# Altium schematic sheet ESP32.SchDoc
size 420 x 297 mm; SheetNumber: 2; SheetTotal: 4
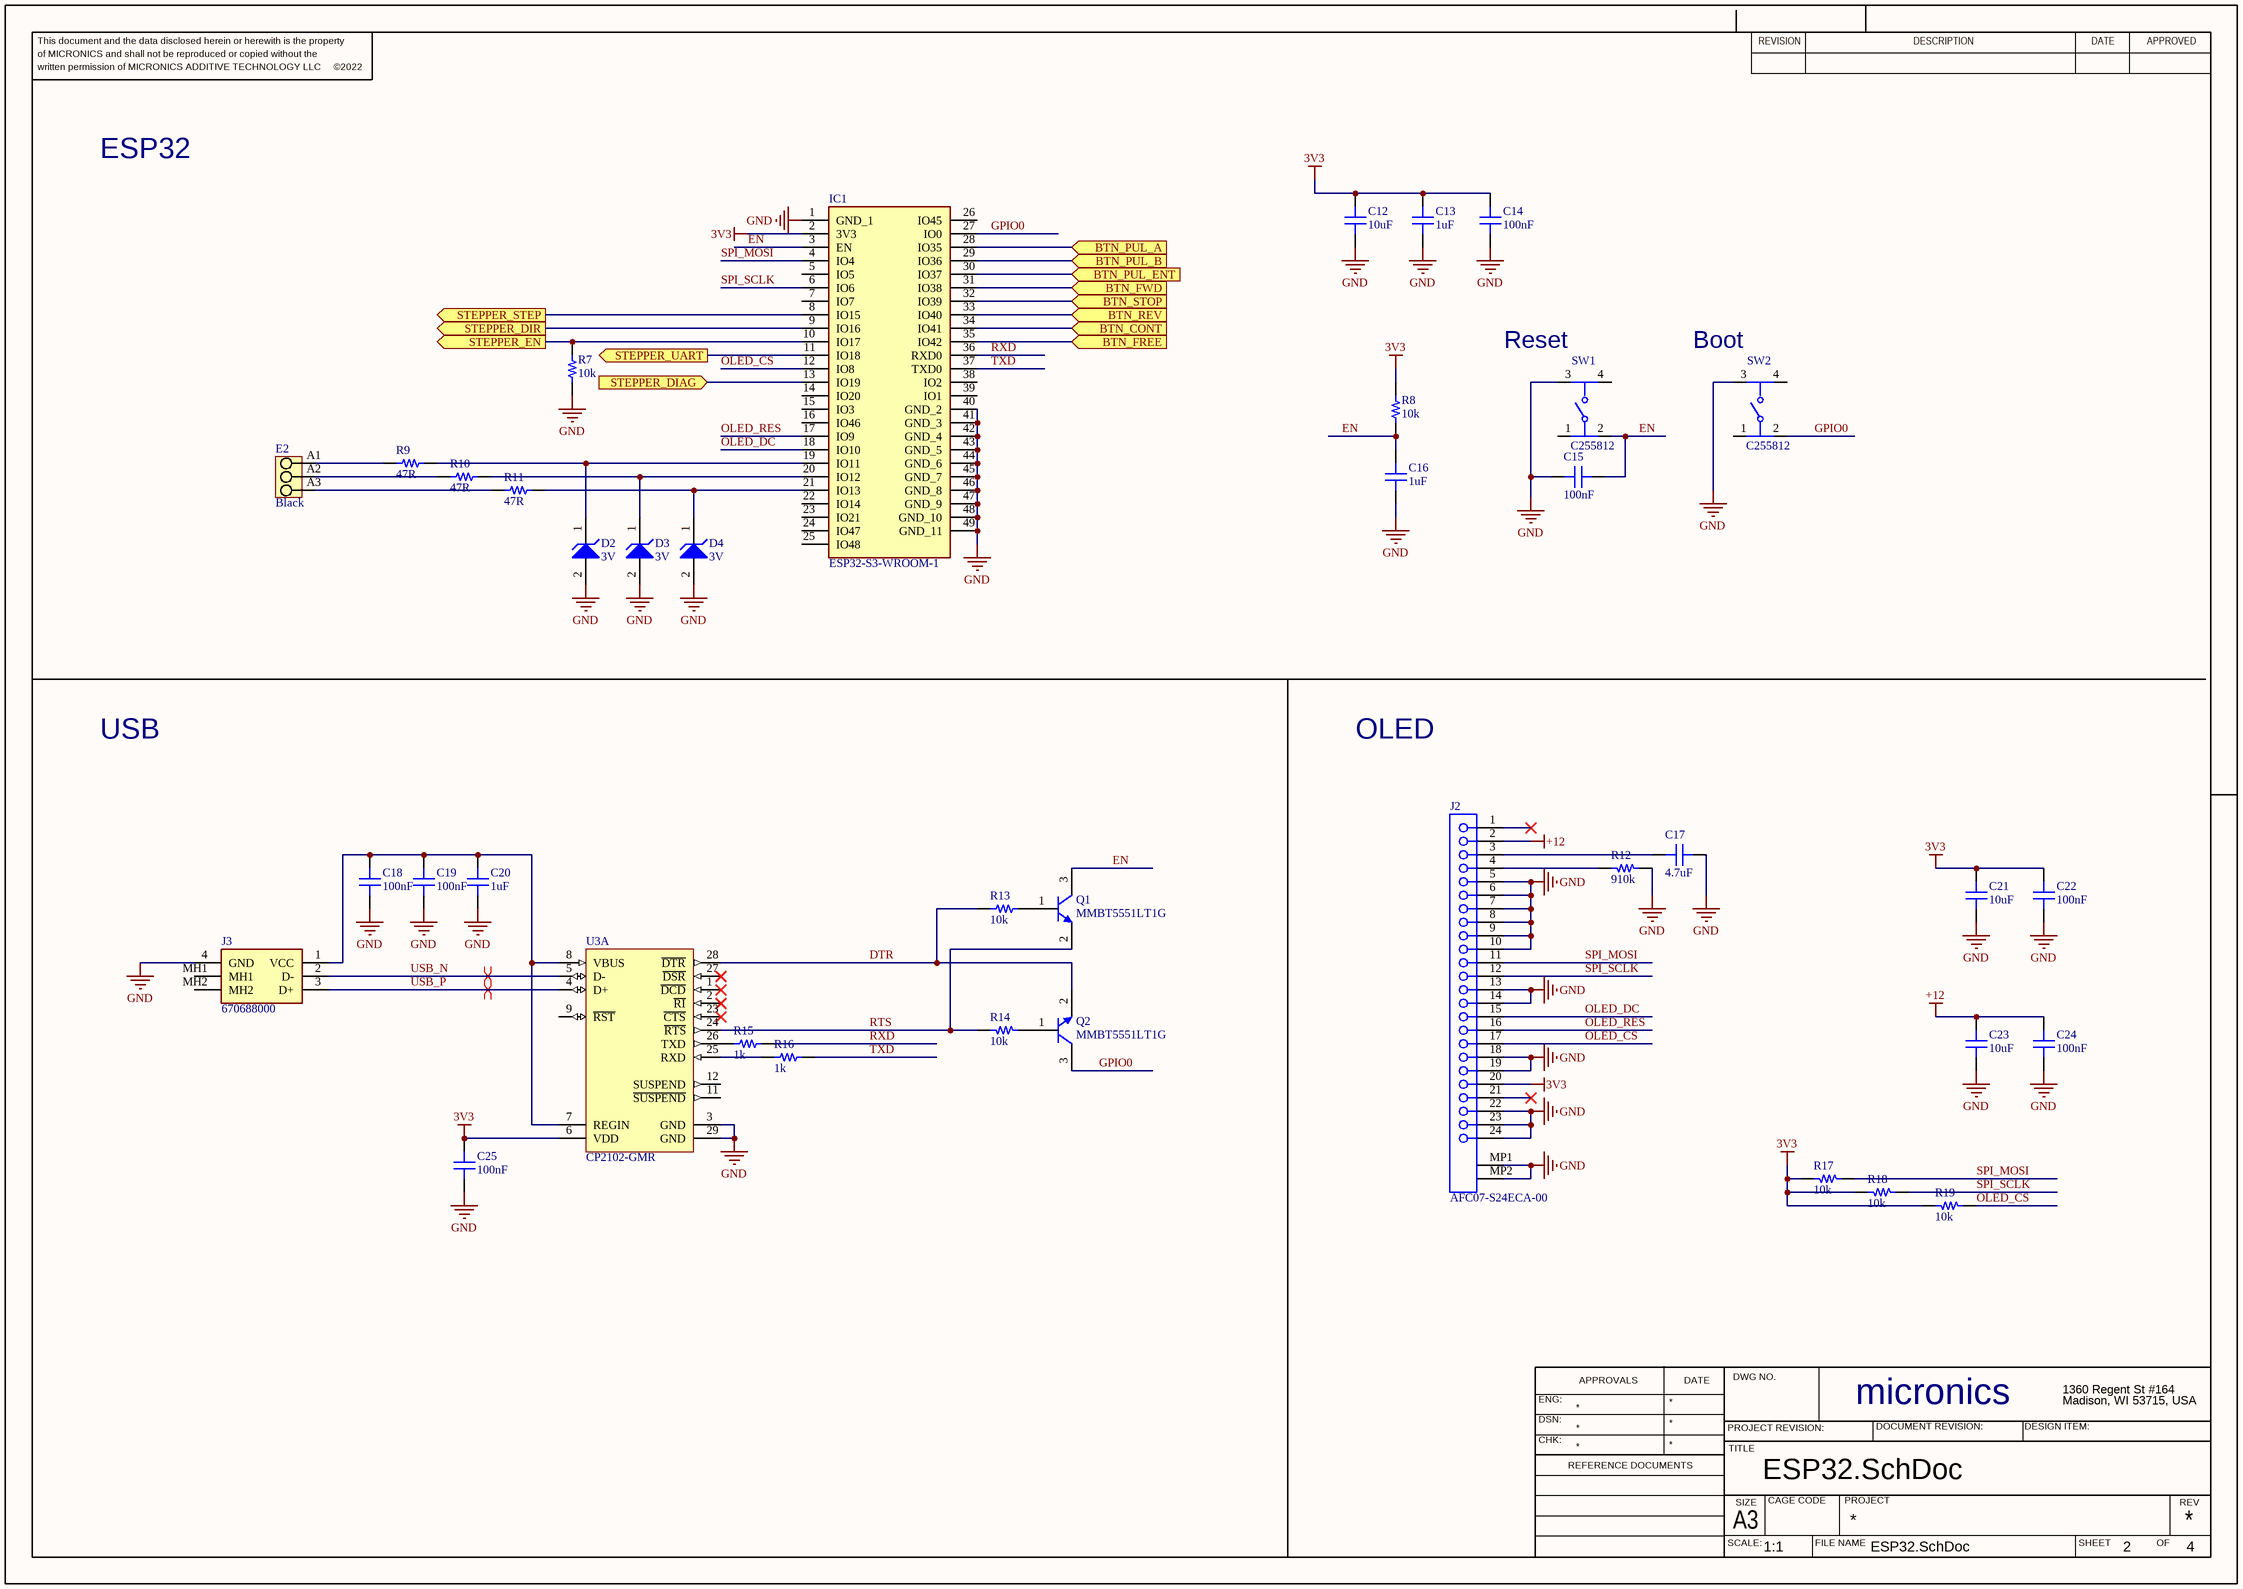
[diagram p0: ESP32.SchDoc]

## Parts
C12  10uF  [CAP 1206_3216 - 0.8MM]
C13  1uF  [CAP 0603_1608]
C14  100nF  [CAP 0603_1608]
C15  100nF  [CAP 0603_1608]
C16  1uF  [CAP 0603_1608]
C17  4.7uF  [CAP 1206_3216 - 0.8MM]
C18  100nF  [CAP 0603_1608]
C19  100nF  [CAP 0603_1608]
C20  1uF  [CAP 0603_1608]
C21  10uF  [CAP 1206_3216 - 0.8MM]
C22  100nF  [CAP 0603_1608]
C23  10uF  [CAP 1206_3216 - 0.8MM]
C24  100nF  [CAP 0603_1608]
C25  100nF  [CAP 0603_1608]
D2  3V  [ONSC-SOD-123-2-425-04_V]
D3  3V  [ONSC-SOD-123-2-425-04_V]
D4  3V  [ONSC-SOD-123-2-425-04_V]
E2  Black  [PM_5_08_90_03]
IC1  ESP32-S3-WROOM-1  [ESP32S3WROOM1]
J2  AFC07-S24ECA-00  [MOLX-52437-2471]
J3  670688000  [670688000]
Q1  MMBT5551LT1G  [ONSC-SOT-23-3-318-08_V]
Q2  MMBT5551LT1G  [ONSC-SOT-23-3-318-08_V]
R7  10k  [RES 0603_1608]
R8  10k  [RES 0603_1608]
R9  47R  [RES 0603_1608]
R10  47R  [RES 0603_1608]
R11  47R  [RES 0603_1608]
R12  910k  [RES 0603_1608]
R13  10k  [RES 0603_1608]
R14  10k  [RES 0603_1608]
R15  1k  [RES 0603_1608]
R16  1k  [RES 0603_1608]
R17  10k  [RES 0603_1608]
R18  10k  [RES 0603_1608]
R19  10k  [RES 0603_1608]
SW1  C255812  [FP-FSM2JSMAA-MFG]
SW2  C255812  [FP-FSM2JSMAA-MFG]
U3  CP2102-GMR  [SLAB-QFN-28-3125x3125TP_M]  (part A of 2)

## Ports
BTN_CONT (in, see Buttons[2C]), BTN_FREE (in, see Buttons[3C]), BTN_FWD (in, see Buttons[5A]), BTN_PUL_A (in, see Buttons[3A]), BTN_PUL_B (in, see Buttons[3B]), BTN_PUL_ENT (in, see Buttons[3B]), BTN_REV (in, see Buttons[5C]), BTN_STOP (in, see Buttons[5B]), STEPPER_DIAG (in), STEPPER_DIR (out, see Stepper[2B]), STEPPER_EN (out, see Stepper[2C]), STEPPER_STEP (out, see Stepper[2B]), STEPPER_UART (out)

## Nets
3V3: C12.2 C13.2 C14.1 C21.2 C22.1 C25.1 IC1.2(3V3) J2.20 R8.1 R17.2 R18.2 R19.2 U3.6(VDD)
+12: C23.2 C24.1 J2.2
GND: C12.1 C13.1 C14.2 C15.2 C16.1 C17.1 C18.2 C19.2 C20.1 C21.1 C22.2 C23.1 C24.2 C25.2 D2.2(A) D3.2(A) D4.2(A) IC1.1(GND_1) IC1.40(GND_2) IC1.41(GND_3) IC1.42(GND_4) IC1.43(GND_5) IC1.44(GND_6) IC1.45(GND_7) IC1.46(GND_8) IC1.47(GND_9) IC1.48(GND_10) IC1.49(GND_11) J2.5 J2.6 J2.7 J2.8 J2.9 J2.10 J2.13 J2.14 J2.18 J2.19 J2.22 J2.23 J2.24 J2.MP1 J2.MP2 J3.4(GND) R7.2 R12.2 SW1.3 SW2.3 U3.3(GND) U3.29(GND)
BTN_CONT: IC1.34(IO41) ; port BTN_CONT
BTN_FREE: IC1.35(IO42) ; port BTN_FREE
BTN_FWD: IC1.31(IO38) ; port BTN_FWD
BTN_PUL_A: IC1.28(IO35) ; port BTN_PUL_A
BTN_PUL_B: IC1.29(IO36) ; port BTN_PUL_B
BTN_PUL_ENT: IC1.30(IO37) ; port BTN_PUL_ENT
BTN_REV: IC1.33(IO40) ; port BTN_REV
BTN_STOP: IC1.32(IO39) ; port BTN_STOP
DTR: Q2.2(E) R13.1 U3.28(~{DTR})
EN: C15.1 C16.2 IC1.3(EN) Q1.3(C) R8.2 SW1.2
GPIO0: IC1.27(IO0) Q2.3(C) SW2.2
OLED_CS: IC1.12(IO8) J2.17 R19.1
OLED_DC: IC1.18(IO10) J2.15
OLED_RES: IC1.17(IO9) J2.16
RTS: Q1.2(E) R14.1 U3.24(~{RTS})
RXD: IC1.36(RXD0) R15.2
SPI_MOSI: IC1.4(IO4) J2.11 R17.1
SPI_SCLK: IC1.6(IO6) J2.12 R18.1
STEPPER_DIAG: IC1.13(IO19) ; port STEPPER_DIAG
STEPPER_DIR: IC1.9(IO16) ; port STEPPER_DIR
STEPPER_EN: IC1.10(IO17) R7.1 ; port STEPPER_EN
STEPPER_STEP: IC1.8(IO15) ; port STEPPER_STEP
STEPPER_UART: IC1.11(IO18) ; port STEPPER_UART
TXD: IC1.37(TXD0) R16.2
USB_N: J3.2(D-) U3.5(D-)
USB_P: J3.3(D+) U3.4(D+)
NetC17_2: C17.2 J2.3
NetC18_1: C18.1 C19.1 C20.2 J3.1(VCC) U3.7(REGIN) U3.8(VBUS)
NetD2_1: D2.1(K) IC1.19(IO11) R9.2
NetD3_1: D3.1(K) IC1.20(IO12) R10.2
NetD4_1: D4.1(K) IC1.21(IO13) R11.2
NetE2_A1: E2.A1 R9.1
NetE2_A2: E2.A2 R10.1
NetE2_A3: E2.A3 R11.1
NetJ2_4: J2.4 R12.1
NetQ1_1: Q1.1(B) R13.2
NetQ2_1: Q2.1(B) R14.2
NetR15_1: R15.1 U3.26(TXD)
NetR16_1: R16.1 U3.25(RXD)

Not connected (* = marked no-connect by the designer): IC1 5(IO5) 7(IO7) 14(IO20) 15(IO3) 16(IO46) 22(IO14) 23(IO21) 24(IO47) 25(IO48) 26(IO45) 38(IO2) 39(IO1); J2 1* 21*; J3 MH1 MH2; SW1 1 4; SW2 1 4; U3 1(~{DCD})* 2(~{RI})* 9(~{RST}) 11(~{SUSPEND}) 12(SUSPEND) 23(~{CTS})* 27(~{DSR})*

## Layout directives
differential pair; differential pair class USB: USB_N, USB_P

## Notes on the sheet
- ESP32
- (near SW1) Reset
- (near SW2) Boot
- USB
- OLED
- This document and the data disclosed herein or herewith is the property
- of MICRONICS and shall not be reproduced or copied without the
- REVISION
- DESCRIPTION
- DATE
- APPROVED
- written permission of MICRONICS ADDITIVE TECHNOLOGY LLC     ©2022
- ENG:
- APPROVALS
- DWG NO.
- micronics
- 1360 Regent St #164
- Madison, WI 53715, USA
- DSN:
- CHK:
- REFERENCE DOCUMENTS
- PROJECT REVISION:
- TITLE
- DOCUMENT REVISION:
- DESIGN ITEM:
- SCALE:
- A3
- SIZE
- CAGE CODE
- FILE NAME
- PROJECT
- SHEET
- OF
- REV
- 1:1

## Library data of the parts
C12 C21 C23 = MM061A101JCT2A: C89632; manufacturer: AVX Corporation; Temperature Coefficient: C0G, NP0; Tolerance: ±5%; Voltage - Rated: 100V; Part Number: MM061A101JCT2A; Value: 10uF; Applications: Medical, Non-Critical; Capacitance: 10uF; componentlink1description: Datasheet; componentlink1url: http://datasheets.avx.com/AVX-MM.pdf; componentlink2description: DigiKey Link; componentlink2url: http://digikey.com/product-detail/en/avx-corporation/MM061A101JCT2A/478-10622-1-ND/7344883; Device Package: 1206 (3216 Metric); lastupdated: 2020-09-02 1:04:46 AM; Lifecycle Status: Active; Minimum Order: 1; Mounting Type: Surface Mount, MLCC; Operating Temperature: -55°C ~ 125°C; Package / Case: 1206 (3216 Metric); packaging: TapeAndReel; partid: 18685; Part Status: Active; price: 0.52; series: MM; Size / Dimension: 0.126" L x 0.063" W (3.20mm x 1.60mm); Supplier 1: DigiKey; Supplier Part Number 1: 478-10622-1-ND; Thickness (Max): 0.029" (0.74mm)
C13 C16 C20 = 250X14W223MV4T: C15849; manufacturer: Johanson Dielectrics Inc.; Temperature Coefficient: X7R; Tolerance: ±20%; Voltage - Rated: 25V; Part Number: 250X14W223MV4T; Value: 1uF; Applications: Bypass, Decoupling; Capacitance: 1uF; componentlink1description: Datasheet; componentlink1url: https://www.johansondielectrics.com/downloads/x2y-filter-and-decoupling-capacitors.pdf; componentlink2description: DigiKey Link; componentlink2url: https://www.digikey.com/en/products/detail/johanson-dielectrics-inc/250X14W223MV4T/1628740; Device Package: 0603 (1608 Metric); Features: Low ESL (X2Y); lastupdated: 2022-05-16 11:25:57 AM; Lifecycle Status: Active; Minimum Order: 1; Mounting Type: Surface Mount, MLCC; Operating Temperature: -55°C ~ 125°C; Package / Case: 0603 (1608 Metric); packaging: TapeAndReel; partid: 14325; Part Status: Active; price: 0.07; series: X2Y®; Size / Dimension: 0.064" L x 0.035" W (1.63mm x 0.89mm); Supplier 1: DigiKey; Supplier Part Number 1: 709-1087-1-ND; Thickness (Max): 0.026" (0.66mm)
C14 C15 C18 C19 C22 C24 C25 = 250X14W223MV4T: C14663; manufacturer: Johanson Dielectrics Inc.; Temperature Coefficient: X7R; Tolerance: ±20%; Voltage - Rated: 25V; Part Number: 250X14W223MV4T; Value: 100nF; Applications: Bypass, Decoupling; Capacitance: 100nF; componentlink1description: Datasheet; componentlink1url: https://www.johansondielectrics.com/downloads/x2y-filter-and-decoupling-capacitors.pdf; componentlink2description: DigiKey Link; componentlink2url: https://www.digikey.com/en/products/detail/johanson-dielectrics-inc/250X14W223MV4T/1628740; Device Package: 0603 (1608 Metric); Features: Low ESL (X2Y); lastupdated: 2022-05-16 11:25:57 AM; Lifecycle Status: Active; Minimum Order: 1; Mounting Type: Surface Mount, MLCC; Operating Temperature: -55°C ~ 125°C; Package / Case: 0603 (1608 Metric); packaging: TapeAndReel; partid: 14325; Part Status: Active; price: 0.07; series: X2Y®; Size / Dimension: 0.064" L x 0.035" W (1.63mm x 0.89mm); Supplier 1: DigiKey; Supplier Part Number 1: 709-1087-1-ND; Thickness (Max): 0.026" (0.66mm)
C17 = MM061A101JCT2A: C29823; manufacturer: AVX Corporation; Temperature Coefficient: C0G, NP0; Tolerance: ±5%; Voltage - Rated: 100V; Part Number: MM061A101JCT2A; Value: 4.7uF; Applications: Medical, Non-Critical; Capacitance: 4.7uF; componentlink1description: Datasheet; componentlink1url: http://datasheets.avx.com/AVX-MM.pdf; componentlink2description: DigiKey Link; componentlink2url: http://digikey.com/product-detail/en/avx-corporation/MM061A101JCT2A/478-10622-1-ND/7344883; Device Package: 1206 (3216 Metric); lastupdated: 2020-09-02 1:04:46 AM; Lifecycle Status: Active; Minimum Order: 1; Mounting Type: Surface Mount, MLCC; Operating Temperature: -55°C ~ 125°C; Package / Case: 1206 (3216 Metric); packaging: TapeAndReel; partid: 18685; Part Status: Active; price: 0.52; series: MM; Size / Dimension: 0.126" L x 0.063" W (3.20mm x 1.60mm); Supplier 1: DigiKey; Supplier Part Number 1: 478-10622-1-ND; Thickness (Max): 0.029" (0.74mm)
D2-D4 = CMP-1060-00257-1: C12756; PartNumber: SZMMSZ12T3G; Manufacturer: On Semiconductor; P Max (W): 0.5; Packing: Tape and Reel; PackageDescription: 2-Pin SOD, Body 1.6 x 2.69 mm; RoHS: Pb-Free; PackageReference: SOD-123-2-425-04; ComponentLink1Description: Manufacturer URL; ComponentLink3URL: http://www.onsemi.com/pub_link/Collateral/425-04.PDF; Mounting Technology: Surface Mount; ComponentLink2URL: http://www.onsemi.com/pub_link/Collateral/MMSZ2V4T1-D.PDF; ComponentLink1URL: http://www.onsemi.com/; ComponentLink3Description: Package Specification; ComponentLink2Description: Datasheet; DatasheetVersion: Rev. 11; PackageVersion: Rev. G, 10/2009
E2 = CMP-1559-01629-1: C430602; PartNumber: 1760500000; Manufacturer: Weidmueller; Pitch_mm: 5,08 mm; Pitch_inch: 0,2 inch; Wire_cross_section_AWG_min_UL_1059: AWG 26; Contact_surface: tinned; Contact_material: Cu-Leg; Short_text_for_material: PM 5.08/03/90 3.5SN OR BX; Rated_voltage_use_group_B_UL_1059: 300 V; Solid_min_H05_07_V_U: 0,13 mm²; Solder_pin_length_mm: 3,5 mm; Rated_voltage_for_surge_voltage_class_pollution_degree_II_2: 600 V; Mounting_onto_the_PCB: Solder connection; Solid_max_H05_07_V_U: 2,5 mm²; Side_termination_characteristic: closed side; Rated_current_use_group_B_UL_1059: 15 A; Wire_cross_section_AWG_max_UL_1059: AWG 14; Insulating_material: Wemid (PA); UL_94_flammability_rating: V-0; No_of_poles: 3; ComponentLink2Description: URL Link1; ComponentLink1Description: Manufacturer URL; ComponentLink2URL: http://catalog.weidmueller.com/catalog/Start.do?localeId=en&ObjectID=1760500000; ComponentLink1URL: http://www.weidmueller.com/; Qty: 500 PCS; Colour: Orange; Packaging: Box; Revision: V1; PackageReference: PM_5_08_90_03
IC1 = ESP32-S3-WROOM-1: Integrated Circuit; Manufacturer_Name: Espressif Systems; Datasheet Link: https://www.mouser.com/catalog/specsheets/Espressif_ESP32_S3_WROOM_1_1U_Preliminary.pdf; Height: 3.25mm; Manufacturer_Part_Number: ESP32-S3-WROOM-1
J2 = CMP-1241-00285-1: C262643; PartNumber: 52437-2471; Manufacturer: Molex; Material - Metal: Phosphor Bronze; Material - Plating Mating: Gold; Durability (mating cycles max): 20; Stackable: No; Contact Position: Bottom; Entry Angle: 90degrees Angle; Circuits (Loaded): 24; Current (Max per Contact): 0.5A; PCB Retention: None; Packing: Tape and Reel; Pitch - Mating Interface: 0.50mm; Polarized to PCB: Yes; Voltage (Max): 50V; ComponentLink2URL: http://www.molex.com/webdocs/datasheets/pdf/en-us/0524372471_FFC_FPC_CONNECTORS.pdf; ComponentLink1URL: http://www.molex.com/molex/index.jsp; Mounting Technology: Surface Mount; RoHS: TRUE; ComponentLink3Description: Package Specification; ComponentLink2Description: Datasheet; PackageReference: 52437-2471; ComponentLink3URL: http://www.molex.com/pdm_docs/sd/524372471_sd.pdf; ComponentLink1Description: Manufacturer URL; PackageVersion: Rev. E, 07/2013; Number of Rows: 1; PCB Locator: No; PackageDescription: 24-Lead FPC Connector, Pitch 0.5 mm; Material - Plating Termination: Gold; Orientation: Right Angle
J3 = 67068-8000: Connector; Manufacturer_Name: Molex; Datasheet Link: https://www.molex.com/pdm_docs/sd/670688000_sd.pdf; Height: 11mm; Manufacturer_Part_Number: 67068-8000; Mouser Part Number: 538-67068-8000; Mouser Price/Stock: https://www.mouser.co.uk/ProductDetail/Molex/67068-8000?qs=N76qWb2E9MLsLGBiHvIzzg%3D%3D
Q1 Q2 = CMP-1048-00669-1: C41095; Manufacturer: On Semiconductor; IC Continuous (A): 0.6; Packing: Tape and Reel; Polarity: NPN; ComponentLink2URL: http://www.onsemi.cn/pub_link/Collateral/MMBT5550LT1-D.PDF; ComponentLink3Description: Package Specification; DatasheetVersion: Rev. 10; ComponentLink1URL: http://www.onsemi.com/; ComponentLink2Description: Datasheet; ComponentLink1Description: Manufacturer URL; PartNumber: MMBT5551LT1G; RoHS: TRUE; PackageReference: SOT-23-3-318-08; Mounting Technology: Surface Mount; PackageVersion: Rev. AP, 11/2009; ComponentLink3URL: http://www.onsemi.cn/pub_link/Collateral/318-08.PDF; PackageDescription: 3-Pin Small Outline Transistor, Body 2.92 x 1.3 mm, Pitch 0.95 mm
R7-R11 R13-R19 = RNCF0603DTE23K2: RES 1% 0603; Manufacturer: Stackpole Electronics Inc; Power (Watts): 0.1W, 1/10W; Temperature Coefficient: ±25ppm/°C; Tolerance: ±0.5%; Part Number: RNCF0603DTE23K2; ComponentLink1Description: Datasheet; ComponentLink1URL: https://www.seielect.com/catalog/sei-rncf.pdf; ComponentLink2Description: DigiKey Link; ComponentLink2URL: https://www.digikey.com/en/products/detail/stackpole-electronics-inc/RNCF0603DTE23K2/6264115; Composition: Thin Film; Device Package: 0603 (1608 Metric); Features: Automotive AEC-Q200; Height - Seated (Max): 0.022" (0.55mm); LastUpdated: 2022-05-20 3:01:33 PM; Lifecycle Status: Active; Minimum Order: 1; Number of Terminations: 2; Operating Temperature: -55°C ~ 155°C; Package / Case: 0603 (1608 Metric); Packaging: TapeAndReel; PartId: 5426; Part Status: Active; Price: 0.01; Ratings: AEC-Q200; Series: RNCF; Size / Dimension: 0.061" L x 0.031" W (1.55mm x 0.80mm); Supplier 1: DigiKey; Supplier Part Number 1: RNCF0603DTE23K2CT-ND; Supplier Device Package: 0603
  R7 R8 R13 R14 R17-R19: Value: 10k; Resistance: 10k
  R9-R11: Value: 47R; Resistance: 47R
  R15 R16: Value: 1k; Resistance: 1k
R12 = RNCS0603BKE10K0: RES 1% 0603; Manufacturer: Stackpole Electronics Inc; Power (Watts): 0.063W, 1/16W; Temperature Coefficient: ±25ppm/°C; Tolerance: ±0.1%; Part Number: RNCS0603BKE10K0; Value: 910k; ComponentLink1Description: Datasheet; ComponentLink1URL: https://www.seielect.com/catalog/sei-rncs_rnch.pdf; ComponentLink2Description: DigiKey Link; ComponentLink2URL: https://www.digikey.com/en/products/detail/stackpole-electronics-inc/RNCS0603BKE10K0/1708836; Composition: Thin Film; Device Package: 0603 (1608 Metric); Features: Anti-Corrosive, Automotive AEC-Q200, Moisture Resistant; Height - Seated (Max): 0.022" (0.55mm); LastUpdated: 2022-05-20 3:01:34 PM; Lifecycle Status: Active; Minimum Order: 1; Number of Terminations: 2; Operating Temperature: -55°C ~ 155°C; Package / Case: 0603 (1608 Metric); Packaging: TapeAndReel; PartId: 4838; Part Status: Active; Price: 0.08; Ratings: AEC-Q200; Resistance: 910k; Series: RNCS; Size / Dimension: 0.061" L x 0.031" W (1.55mm x 0.80mm); Supplier 1: DigiKey; Supplier Part Number 1: RNCS0603BKE10K0CT-ND; Supplier Device Package: 0603
SW1 SW2 = CMP-03402-000003-1: SWITCH TACTILE SPST-NO 0.05A 24V; Manufacturer Part Number: FSM2JSMAA; Manufacturer: TE Connectivity; Standoff Height: 0.05mm; Contact Current Rating: 50mA; Electromechanical Life: 100000Cycles; Operating Force: 260gf; Contact Resistance: 100mΩ; Package: 0; Temperature Range High: +85°C; Temperature: -35°C to +85°C; Category: Switch; RoHS: TRUE; Mouser Description: Tactile Switches TACTILE 260G FORCE S; Device Class L1: Electromechanical; Mount: Surface Mount; Height: 4.59mm; ComponentLink2URL: https://www.te.com/commerce/DocumentDelivery/DDEController?Action=showdoc&DocId=Customer+Drawing%7F2-1437565-7%7FV%7Fpdf%7FEnglish%7FENG_CD_2-1437565-7_V.pdf%7F2-1437565-8; Temperature Range Low: -35°C; Voltage Rating Dc: 24V; Lead Free: Yes; Automotive: No; Throw Configuration: SPST-NO; Octopart: https://octopart.com/fsm2jsmaa-te+connectivity-41720620; Device Class L2: Switches; Device Class L3: Pushbutton Switches; ComponentLink2Description: Datasheet; Digikey Description: SWITCH TACTILE SPST-NO 0.05A 24V
U3 = CMP-2000-04924-1: Single-Chip USB to URAT Bridge, 3.3 V, -40 to 85 degC, 28-Pin QFN, RoHS, Tape and Reel; Manufacturer: Silicon Labs; Interface Circuit Standard 1: RS-232; Transmitter and Receiver FIFO Counter: No; Supply Current: 26mA; Operating Supply Voltage (Min): 3V; Operating Supply Voltage (Typ): 3.3V; Data Rate: 1000kbps; Operating Supply Voltage (Max): 3.6V; Number of Channels: 1; Package URL: http://www.silabs.com/Support%20Documents/TechnicalDocs/C8051T61x.pdf; Operating Temperature (Max): 85C; Datasheet URL: http://www.mouser.com/ds/2/368/CP2102-9-247052.pdf; Operating Temperature Classification: Industrial; Operating Temperature (Min): -40C; Package Description: 28-Pin Quad-Flat No-Leads Package, Body 5 x 5 mm, Pitch 0.5 mm; Manufacturer URL: http://www.silabs.com/; Rad Hardened: No; Package Reference: QFN-28; Pin Count: 28; Packaging: TapeandReel; Mounting: SurfaceMount; Package Type: QFNEP; Datasheet Version: Rev. 1.6, 12/2013